# EAGLE schematic ALU (EAGLE 9.6.2)
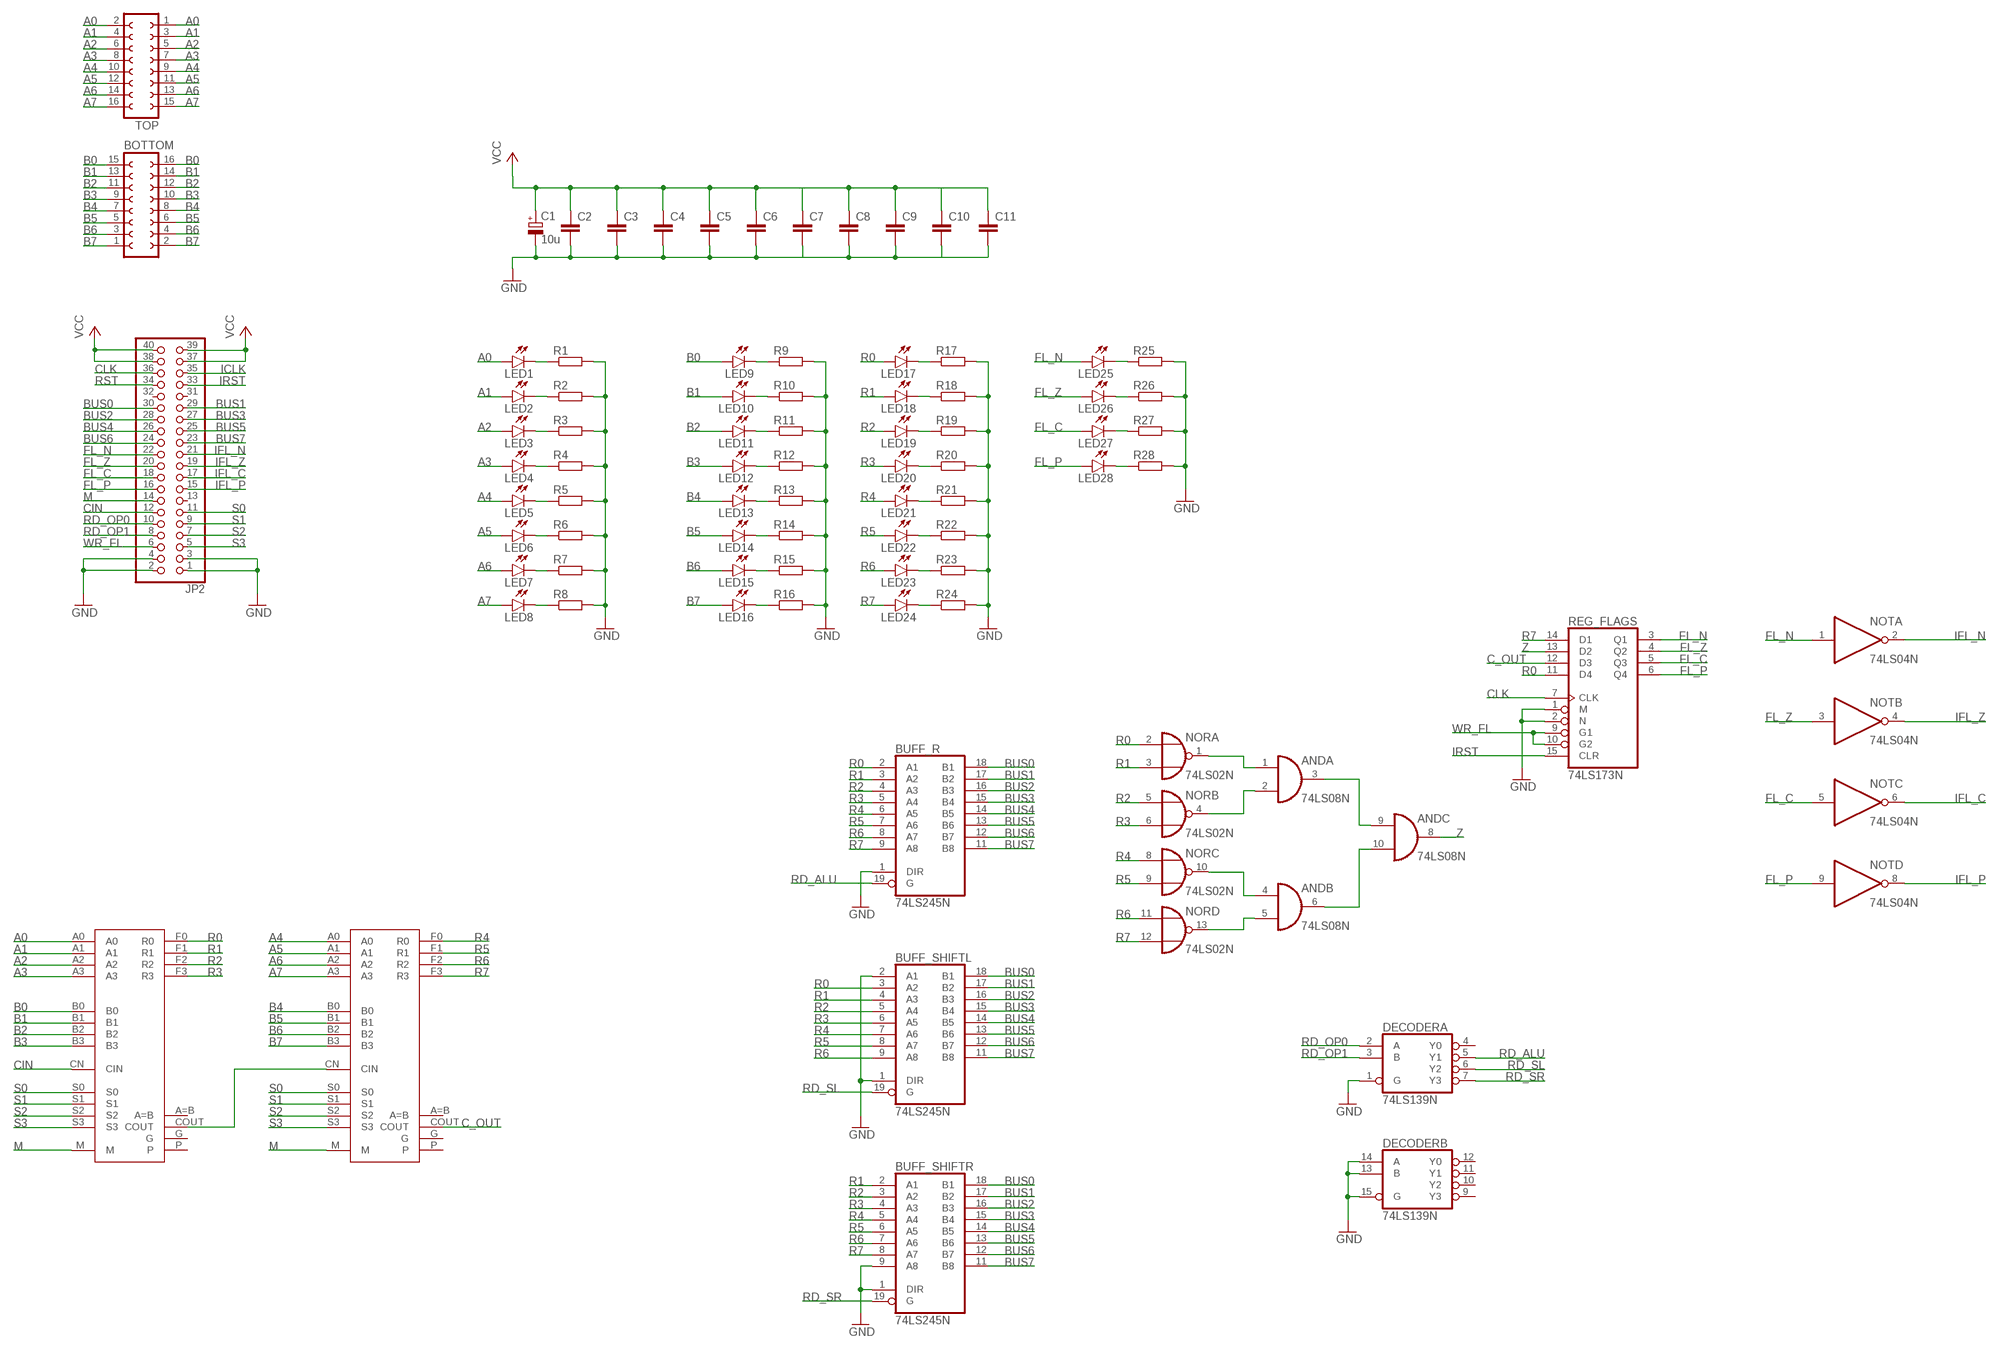
[diagram p0: schematic, sheet 1]

## Parts
ALU0  ALU_74181  [ALU_74181]
ALU1  ALU_74181  [ALU_74181]
AND  74LS08N  [DIL14]
BOTTOM  FE08-2W  [FE08-2W]
BUFF_R  74LS245N  [DIL20]
BUFF_SHIFTL  74LS245N  [DIL20]
BUFF_SHIFTR  74LS245N  [DIL20]
C1  10u  CPOL-EUE5-8.5  [E5-8,5]
C2  C5/2.5  [C5B2.5]
C3  C5/2.5  [C5B2.5]
C4  C5/2.5  [C5B2.5]
C5  C5/2.5  [C5B2.5]
C6  C5/2.5  [C5B2.5]
C7  C5/2.5  [C5B2.5]
C8  C5/2.5  [C5B2.5]
C9  C5/2.5  [C5B2.5]
C10  C5/2.5  [C5B2.5]
C11  C5/2.5  [C5B2.5]
DECODER  74LS139N  [DIL16]
JP2  PINHD-2X20/90  [2X20/90]
LED1  LEDSML1206  [SML1206]
LED2  LEDSML1206  [SML1206]
LED3  LEDSML1206  [SML1206]
LED4  LEDSML1206  [SML1206]
LED5  LEDSML1206  [SML1206]
LED6  LEDSML1206  [SML1206]
LED7  LEDSML1206  [SML1206]
LED8  LEDSML1206  [SML1206]
LED9  LEDSML1206  [SML1206]
LED10  LEDSML1206  [SML1206]
LED11  LEDSML1206  [SML1206]
LED12  LEDSML1206  [SML1206]
LED13  LEDSML1206  [SML1206]
LED14  LEDSML1206  [SML1206]
LED15  LEDSML1206  [SML1206]
LED16  LEDSML1206  [SML1206]
LED17  LEDSML1206  [SML1206]
LED18  LEDSML1206  [SML1206]
LED19  LEDSML1206  [SML1206]
LED20  LEDSML1206  [SML1206]
LED21  LEDSML1206  [SML1206]
LED22  LEDSML1206  [SML1206]
LED23  LEDSML1206  [SML1206]
LED24  LEDSML1206  [SML1206]
LED25  LEDSML1206  [SML1206]
LED26  LEDSML1206  [SML1206]
LED27  LEDSML1206  [SML1206]
LED28  LEDSML1206  [SML1206]
NOR  74LS02N  [DIL14]
NOT  74LS04N  [DIL14]
R1  R-EU_R0805  [R0805]
R2  R-EU_R0805  [R0805]
R3  R-EU_R0805  [R0805]
R4  R-EU_R0805  [R0805]
R5  R-EU_R0805  [R0805]
R6  R-EU_R0805  [R0805]
R7  R-EU_R0805  [R0805]
R8  R-EU_R0805  [R0805]
R9  R-EU_R0805  [R0805]
R10  R-EU_R0805  [R0805]
R11  R-EU_R0805  [R0805]
R12  R-EU_R0805  [R0805]
R13  R-EU_R0805  [R0805]
R14  R-EU_R0805  [R0805]
R15  R-EU_R0805  [R0805]
R16  R-EU_R0805  [R0805]
R17  R-EU_R0805  [R0805]
R18  R-EU_R0805  [R0805]
R19  R-EU_R0805  [R0805]
R20  R-EU_R0805  [R0805]
R21  R-EU_R0805  [R0805]
R22  R-EU_R0805  [R0805]
R23  R-EU_R0805  [R0805]
R24  R-EU_R0805  [R0805]
R25  R-EU_R0805  [R0805]
R26  R-EU_R0805  [R0805]
R27  R-EU_R0805  [R0805]
R28  R-EU_R0805  [R0805]
REG_FLAGS  74LS173N  [DIL16]
TOP  FE08-2W  [FE08-2W]

## Nets
A0: ALU0.A0 LED1.A TOP.1 TOP.2
A1: ALU0.A1 LED2.A TOP.3 TOP.4
A2: ALU0.A2 LED3.A TOP.5 TOP.6
A3: ALU0.A3 LED4.A TOP.7 TOP.8
A4: ALU1.A0 LED5.A TOP.9 TOP.10
A5: ALU1.A1 LED6.A TOP.11 TOP.12
A6: ALU1.A2 LED7.A TOP.13 TOP.14
A7: ALU1.A3 LED8.A TOP.15 TOP.16
B0: ALU0.B0 BOTTOM.15 BOTTOM.16 LED9.A
B1: ALU0.B1 BOTTOM.13 BOTTOM.14 LED10.A
B2: ALU0.B2 BOTTOM.11 BOTTOM.12 LED11.A
B3: ALU0.B3 BOTTOM.9 BOTTOM.10 LED12.A
B4: ALU1.B0 BOTTOM.7 BOTTOM.8 LED13.A
B5: ALU1.B1 BOTTOM.5 BOTTOM.6 LED14.A
B6: ALU1.B2 BOTTOM.3 BOTTOM.4 LED15.A
B7: ALU1.B3 BOTTOM.1 BOTTOM.2 LED16.A
BUS0: BUFF_R.18(B1) BUFF_SHIFTL.18(B1) BUFF_SHIFTR.18(B1) JP2.30
BUS1: BUFF_R.17(B2) BUFF_SHIFTL.17(B2) BUFF_SHIFTR.17(B2) JP2.29
BUS2: BUFF_R.16(B3) BUFF_SHIFTL.16(B3) BUFF_SHIFTR.16(B3) JP2.28
BUS3: BUFF_R.15(B4) BUFF_SHIFTL.15(B4) BUFF_SHIFTR.15(B4) JP2.27
BUS4: BUFF_R.14(B5) BUFF_SHIFTL.14(B5) BUFF_SHIFTR.14(B5) JP2.26
BUS5: BUFF_R.13(B6) BUFF_SHIFTL.13(B6) BUFF_SHIFTR.13(B6) JP2.25
BUS6: BUFF_R.12(B7) BUFF_SHIFTL.12(B7) BUFF_SHIFTR.12(B7) JP2.24
BUS7: BUFF_R.11(B8) BUFF_SHIFTL.11(B8) BUFF_SHIFTR.11(B8) JP2.23
C_OUT: ALU1.COUT REG_FLAGS.12(D3)
CIN: ALU0.CN(CIN) JP2.12
CLK: JP2.36 REG_FLAGS.7(CLK)
FL_C: JP2.18 LED27.A NOT.5(C:I) REG_FLAGS.5(Q3)
FL_N: JP2.22 LED25.A NOT.1(A:I) REG_FLAGS.3(Q1)
FL_P: JP2.16 LED28.A NOT.9(D:I) REG_FLAGS.6(Q4)
FL_Z: JP2.20 LED26.A NOT.3(B:I) REG_FLAGS.4(Q2)
GND: BUFF_R.1(DIR) BUFF_SHIFTL.1(DIR) BUFF_SHIFTL.2(A1) BUFF_SHIFTR.1(DIR) BUFF_SHIFTR.9(A8) C1.- C2.2 C3.2 C4.2 C5.2 C6.2 C7.2 C8.2 C9.2 C10.2 DECODER.1(A:G) DECODER.13(B:B) DECODER.14(B:A) DECODER.15(B:G) JP2.1 JP2.2 JP2.3 JP2.4 R1.2 R2.2 R3.2 R4.2 R5.2 R6.2 R7.2 R8.2 R9.2 R10.2 R11.2 R12.2 R13.2 R14.2 R15.2 R16.2 R17.2 R18.2 R19.2 R20.2 R21.2 R22.2 R23.2 R24.2 R25.2 R26.2 R27.2 R28.2 REG_FLAGS.1(M) REG_FLAGS.2(N)
GND1: C11.2
ICLK: JP2.35
IFL_C: JP2.17 NOT.6(C:O)
IFL_N: JP2.21 NOT.2(A:O)
IFL_P: JP2.15 NOT.8(D:O)
IFL_Z: JP2.19 NOT.4(B:O)
IRST: JP2.33 REG_FLAGS.15(CLR)
M: ALU0.M ALU1.M JP2.14
N$1: ALU0.COUT ALU1.CN(CIN)
N$2: AND.1(A:I0) NOR.1(A:O)
N$3: AND.2(A:I1) NOR.4(B:O)
N$4: AND.4(B:I0) NOR.10(C:O)
N$5: AND.5(B:I1) NOR.13(D:O)
N$6: AND.6(B:O) AND.10(C:I1)
N$7: AND.3(A:O) AND.9(C:I0)
N$9: LED1.C R1.1
N$10: LED2.C R2.1
N$11: LED3.C R3.1
N$12: LED4.C R4.1
N$13: LED5.C R5.1
N$14: LED6.C R6.1
N$15: LED7.C R7.1
N$16: LED8.C R8.1
N$18: LED9.C R9.1
N$19: LED10.C R10.1
N$20: LED11.C R11.1
N$21: LED12.C R12.1
N$22: LED13.C R13.1
N$23: LED14.C R14.1
N$24: LED15.C R15.1
N$25: LED16.C R16.1
N$27: LED17.C R17.1
N$28: LED18.C R18.1
N$29: LED19.C R19.1
N$30: LED20.C R20.1
N$31: LED21.C R21.1
N$32: LED22.C R22.1
N$33: LED23.C R23.1
N$34: LED24.C R24.1
N$35: LED25.C R25.1
N$36: LED26.C R26.1
N$37: LED27.C R27.1
N$38: LED28.C R28.1
R0: ALU0.F0(R0) BUFF_R.2(A1) BUFF_SHIFTL.3(A2) LED17.A NOR.2(A:I0) REG_FLAGS.11(D4)
R1: ALU0.F1(R1) BUFF_R.3(A2) BUFF_SHIFTL.4(A3) BUFF_SHIFTR.2(A1) LED18.A NOR.3(A:I1)
R2: ALU0.F2(R2) BUFF_R.4(A3) BUFF_SHIFTL.5(A4) BUFF_SHIFTR.3(A2) LED19.A NOR.5(B:I0)
R3: ALU0.F3(R3) BUFF_R.5(A4) BUFF_SHIFTL.6(A5) BUFF_SHIFTR.4(A3) LED20.A NOR.6(B:I1)
R4: ALU1.F0(R0) BUFF_R.6(A5) BUFF_SHIFTL.7(A6) BUFF_SHIFTR.5(A4) LED21.A NOR.8(C:I0)
R5: ALU1.F1(R1) BUFF_R.7(A6) BUFF_SHIFTL.8(A7) BUFF_SHIFTR.6(A5) LED22.A NOR.9(C:I1)
R6: ALU1.F2(R2) BUFF_R.8(A7) BUFF_SHIFTL.9(A8) BUFF_SHIFTR.7(A6) LED23.A NOR.11(D:I0)
R7: ALU1.F3(R3) BUFF_R.9(A8) BUFF_SHIFTR.8(A7) LED24.A NOR.12(D:I1) REG_FLAGS.14(D1)
RD_ALU: BUFF_R.19(G) DECODER.5(A:Y1)
RD_OP0: DECODER.2(A:A) JP2.10
RD_OP1: DECODER.3(A:B) JP2.8
RD_SL: BUFF_SHIFTL.19(G) DECODER.6(A:Y2)
RD_SR: BUFF_SHIFTR.19(G) DECODER.7(A:Y3)
RST: JP2.34
S0: ALU0.S0 ALU1.S0 JP2.11
S1: ALU0.S1 ALU1.S1 JP2.9
S2: ALU0.S2 ALU1.S2 JP2.7
S3: ALU0.S3 ALU1.S3 JP2.5
VCC: JP2.37 JP2.38 JP2.39 JP2.40
VCC1: C1.+ C2.1 C3.1 C4.1 C5.1 C6.1 C7.1 C8.1 C9.1 C10.1
VCC2: C11.1
WR_FL: JP2.6 REG_FLAGS.9(G1) REG_FLAGS.10(G2)
Z: AND.8(C:O) REG_FLAGS.13(D2)
Unconnected: ALU0.A=B ALU0.G ALU0.P ALU1.A=B ALU1.G ALU1.P AND.11(D:O) AND.12(D:I0) AND.13(D:I1) DECODER.4(A:Y0) DECODER.9(B:Y3) DECODER.10(B:Y2) DECODER.11(B:Y1) DECODER.12(B:Y0) JP2.13 JP2.31 JP2.32 NOT.10(E:O) NOT.11(E:I) NOT.12(F:O) NOT.13(F:I)

## Power pins joined to a net without a drawn wire
GND: AND.7(P:GND) BUFF_R.10(GND) BUFF_SHIFTL.10(GND) BUFF_SHIFTR.10(GND) DECODER.8(P:GND) NOR.7(P:GND) NOT.7(P:GND) REG_FLAGS.8(GND)
VCC: AND.14(P:VCC) BUFF_R.20(VCC) BUFF_SHIFTL.20(VCC) BUFF_SHIFTR.20(VCC) DECODER.16(P:VCC) NOR.14(P:VCC) NOT.14(P:VCC) REG_FLAGS.16(VCC)

## Library data of the parts
ALU0 ALU1 = IsaacAlonso:ALU_74181
AND = 74xx-eu:74*08: Quad 2-input AND gate
BOTTOM TOP = con-lsta:FE08-2W: FEMALE HEADER; OC_FARNELL: unknown; OC_NEWARK: unknown
BUFF_R BUFF_SHIFTL BUFF_SHIFTR = 74xx-eu:74*245: Octal BUS TRANSCEIVER, 3-state
C1 = rcl:CPOL-EU: POLARIZED CAPACITOR, European symbol; SPICEPREFIX: C
C2-C11 = capacitor-wima:C: CAPACITOR naming: grid - package width
DECODER = 74xx-eu:74*139: Dual 2-line to 4-line DECODER/DEMULTIPLEXER
JP2 = pinhead:PINHD-2X20: PIN HEADER
LED1-LED28 = led:LED: LED OSRAM: - CHIPLED LG R971, LG N971, LY N971, LG Q971, LY Q971, LO R971, LY R971 LH N974, LH R974 LS Q976, LO Q976, LY Q976 LO Q996 - Hyper CHIPLED LW Q18S LB Q993, LB Q99A, LB R99A - SideLED LS A670, LO A670, LY A670, LG A670, LP A670 LB A673, LV A673, LT A673, LW A673 LH A674 LY A675 LS A676, LA A676, LO A676, LY A676, LW A676 LS A679, LY A679, LG A679 - Hyper Micro SIDELED® LS Y876, LA Y876, LO Y876, LY Y876 LT Y87S - SmartLED LW L88C, LW L88S LB L89C, LB L89S, LG L890 LS L89K, LO L89K, LY L89K LS L896, LA L896, LO L896, LY L896 - TOPLED LS T670, LO T670, LY T670, LG T670, LP T670 LSG T670, LSP T670, LSY T670, LOP T670, LYG T670 LG T671, LOG T671, LSG T671 LB T673, LV T673, LT T673, LW T673 LH T674 LS T676, LA T676, LO T676, LY T676, LB T676, LH T676, LSB T676, LW T676 LB T67C, LV T67C, LT T67C, LS T67K, LO T67K, LY T67K, LW E67C LS E67B, LA E67B, LO E67B, LY E67B, LB E67C, LV E67C, LT E67C LW T67C LS T679, LY T679, LG T679 LS T770, LO T770, LY T770, LG T770, LP T770 LB T773, LV T773, LT T773, LW T773 LH T774 LS E675, LA E675, LY E675, LS T675 LS T776, LA T776, LO T776, LY T776, LB T776 LHGB T686 LT T68C, LB T68C - Hyper Mini TOPLED® LB M676 - Mini TOPLED Santana® LG M470 LS M47K, LO M47K, LY M47K Source: http://www.osram.convergy.de LUXEON: - LUMILED® LXK2-PW12-R00, LXK2-PW12-S00, LXK2-PW14-U00, LXK2-PW14-V00 LXK2-PM12-R00, LXK2-PM12-S00, LXK2-PM14-U00 LXK2-PE12-Q00, LXK2-PE12-R00, LXK2-PE12-S00, LXK2-PE14-T00, LXK2-PE14-U00 LXK2-PB12-K00, LXK2-PB12-L00, LXK2-PB12-M00, LXK2-PB14-N00, LXK2-PB14-P00, LXK2-PB14-Q00 LXK2-PR12-L00, LXK2-PR12-M00, LXK2-PR14-Q00, LXK2-PR14-R00 LXK2-PD12-Q00, LXK2-PD12-R00, LXK2-PD12-S00 LXK2-PH12-R00, LXK2-PH12-S00 LXK2-PL12-P00, LXK2-PL12-Q00, LXK2-PL12-R00 Source: www.luxeon.com KINGBRIGHT: KA-3528ASYC Source: www.kingbright.com
NOR = 74xx-eu:74*02: Quad 2-input NOR gate
NOT = 74xx-eu:74*04: Hex INVERTER
R1-R28 = rcl:R-EU_: RESISTOR, European symbol; SPICEPREFIX: R
REG_FLAGS = 74xx-eu:74*173: 4-bit D type REGISTER, 3-state